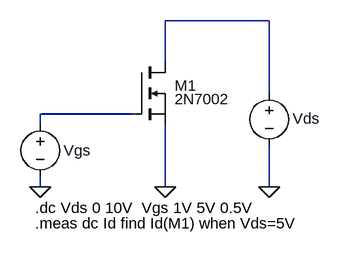
[diagram p0: schematic ID_vs_UDS-measure.asc]
ID_vs_UDS-measure.asc, the LTspice schematic file:
Version 4
SHEET 1 1292 680
WIRE -560 -128 -720 -128
WIRE -720 -64 -720 -128
WIRE -560 -16 -560 -128
WIRE -768 16 -912 16
WIRE -912 32 -912 16
WIRE -912 128 -912 112
WIRE -720 128 -720 32
WIRE -560 128 -560 64
FLAG -560 128 0
FLAG -912 128 0
FLAG -720 128 0
SYMBOL voltage -560 -32 R0
WINDOW 123 0 0 Left 2
WINDOW 39 37 60 Left 2
WINDOW 0 36 55 Left 2
WINDOW 3 37 60 Left 2
SYMATTR InstName Vds
SYMATTR Value ""
SYMBOL voltage -912 16 R0
WINDOW 123 0 0 Left 2
WINDOW 39 40 53 Left 2
WINDOW 3 40 69 Left 2
WINDOW 0 36 56 Left 2
SYMATTR Value ""
SYMATTR InstName Vgs
SYMBOL nmos -768 -64 R0
WINDOW 0 63 36 Left 2
WINDOW 3 63 57 Left 2
SYMATTR InstName M1
SYMATTR Value 2N7002
TEXT -920 160 Left 2 !.dc Vds 0 10V  Vgs 1V 5V 0.5V
TEXT -920 184 Left 2 !.meas dc Id find Id(M1) when Vds=5V

The netlist it stands for:
* ID_vs_UDS-measure.asc
Vds N001 0
Vgs N002 0
M1 N001 N002 0 0 2N7002
.model NMOS NMOS
.model PMOS PMOS
.lib standard.mos
.dc Vds 0 10V  Vgs 1V 5V 0.5V
.meas dc Id find Id(M1) when Vds=5V
.backanno
.end